# Altium schematic sheet 93.SchDoc: P30L
size A4; Engineer: Kang jin; Organization: 六零加智能科技; Address4: www.nidone.com.cn; DocumentNumber: kang jin; Revision: 1.0; SheetNumber: 23; SheetTotal: 23
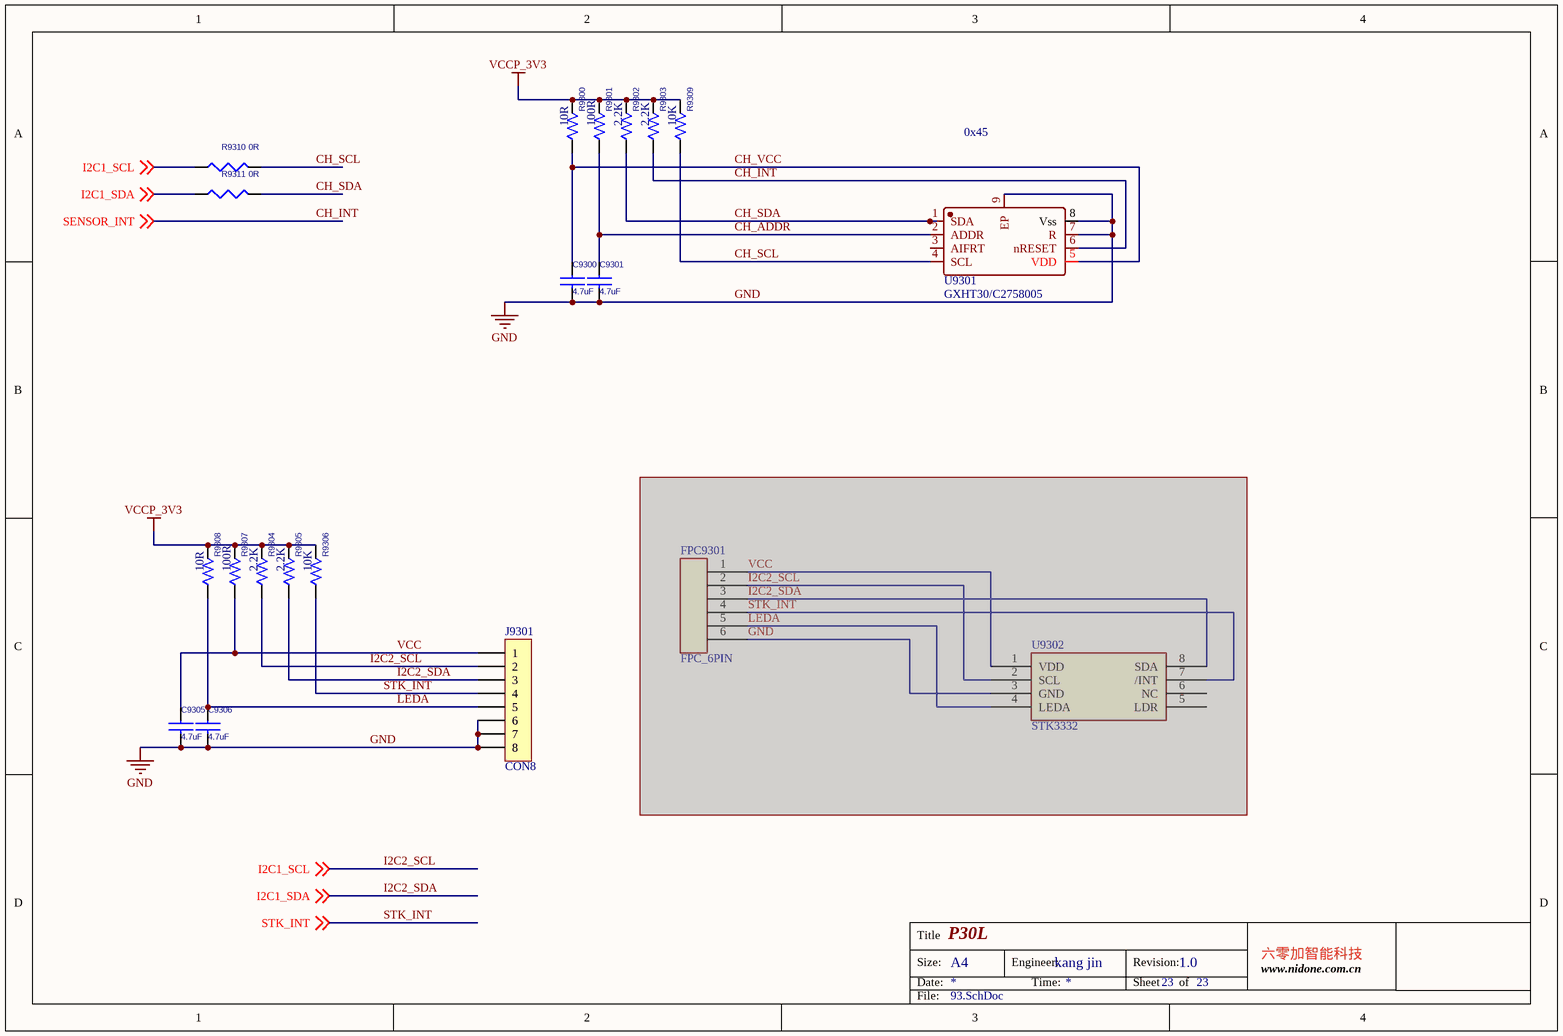
[diagram p0: 93.SchDoc]

## Parts
C9300  4.7uF  [C0402]
C9301  4.7uF  [C0402]
C9305  4.7uF  [C0402]
C9306  4.7uF  [C0402]
FPC9301  FPC_6PIN  [FPC_6Pin]  (masked out: inside a compile mask, not in the netlist)
J9301  CON8  [X05A10H06G]
R9300  10R  [R0402]
R9301  100R  [R0402]
R9302  2.2K  [R0402]
R9303  2.2K  [R0402]
R9304  2.2K  [R0402]
R9305  2.2K  [R0402]
R9306  10K  [R0402]
R9307  100R  [R0402]
R9308  10R  [R0402]
R9309  10K  [R0402]
R9310  0R  [R0402]
R9311  0R  [R0402]
U9301  GXHT30/C2758005  [DFN-8]
U9302  STK3332  [STK3332]  (masked out: inside a compile mask, not in the netlist)

## Nets
GND: C9300.2 C9301.2 C9305.2 C9306.2 J9301.6 J9301.7 J9301.8 U9301.7(R) U9301.8(Vss) U9301.9(EP)
VCCP_3V3: R9300.2 R9301.2 R9302.2 R9303.2 R9304.2 R9305.2 R9306.2 R9307.2 R9308.2 R9309.2
CH_ADDR: C9301.1 R9301.1 U9301.2(ADDR)
CH_INT: R9303.1 U9301.6(nRESET) ; off-sheet SENSOR_INT  [also labelled SENSOR_INT]
CH_SCL: R9309.1 R9310.2 U9301.4(SCL)
CH_SDA: R9302.1 R9311.2 U9301.1(SDA)
CH_VCC: C9300.1 R9300.1 U9301.5(VDD)
I2C2_SCL: J9301.2 R9304.1 R9310.1 ; off-sheet I2C1_SCL  [also labelled I2C1_SCL]
I2C2_SDA: J9301.3 R9305.1 R9311.1 ; off-sheet I2C1_SDA  [also labelled I2C1_SDA]
LEDA: C9306.1 J9301.5 R9308.1
STK_INT: J9301.4 R9306.1 ; off-sheet STK_INT
VCC: C9305.1 J9301.1 R9307.1

Not connected (* = marked no-connect by the designer): U9301 3(AIFRT)

## Notes on the sheet
- 0x45
- Title
- Size:
- Date:
- A4
- Engineer:
- Time:
- Revision:
- Sheet
- of
- File:

## Library data of the parts
C9300 C9301 C9305 C9306 = C0603
J9301 = CON8: Connector; pin to pad: 2>4 4>2 7>none 8>none
R9300 R9308 = R: ROHS CHIP RES 10R 1/16W 1%; DIST: FLAT; PSpiceTemplate: R^@REFDES %1 %2 ?TOLERANCE|R^@REFDES| @VALUE  ?TOLERANCE|\n.model R^@REFDES RES R=1 DEV=@TOLERANCE%|; VOLTAGE: RVMAX; SLOPE: RSMAX; MAX_TEMP: RTMAX; POWER: RMAX; Value: 10R
R9301 R9307 = R: ROHS CHIP RES 100R1/16W 1%; DIST: FLAT; PSpiceTemplate: R^@REFDES %1 %2 ?TOLERANCE|R^@REFDES| @VALUE  ?TOLERANCE|\n.model R^@REFDES RES R=1 DEV=@TOLERANCE%|; VOLTAGE: RVMAX; SLOPE: RSMAX; MAX_TEMP: RTMAX; POWER: RMAX; Value: 100R
R9302-R9305 = R: ROHS CHIP RES 2.2K 1/16W 1%; DIST: FLAT; PSpiceTemplate: R^@REFDES %1 %2 ?TOLERANCE|R^@REFDES| @VALUE  ?TOLERANCE|\n.model R^@REFDES RES R=1 DEV=@TOLERANCE%|; VOLTAGE: RVMAX; SLOPE: RSMAX; MAX_TEMP: RTMAX; POWER: RMAX; Value: 2.2K
R9306 R9309 = R: ROHS CHIP RES 10K 1/16W 1%; DIST: FLAT; PSpiceTemplate: R^@REFDES %1 %2 ?TOLERANCE|R^@REFDES| @VALUE  ?TOLERANCE|\n.model R^@REFDES RES R=1 DEV=@TOLERANCE%|; VOLTAGE: RVMAX; SLOPE: RSMAX; MAX_TEMP: RTMAX; POWER: RMAX; Value: 10K
R9310 R9311 = R/0402(H)
U9301 = GXHT30